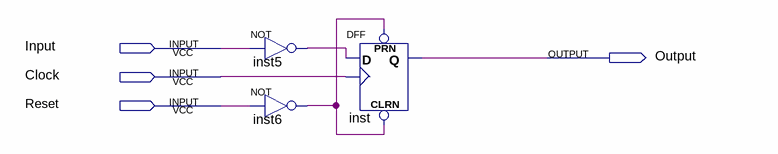
[diagram p0: schematic sheet]
// Quartus schematic HW2_P3.bdf as structural Verilog: 3 symbols, 4 pins
module HW2_P3 (
  input  Input,
  input  Clock,
  input  Reset,
  output Output
);

  wire inst5_out, inst6_out;

  not inst5 (inst5_out, Input);
  not inst6 (inst6_out, Reset);
  DFF inst (.CLRN(inst6_out), .CLK(Clock), .D(inst5_out), .PRN(inst6_out), .Q(Output));
endmodule
